# Altium project bitfury_power.PrjPCB
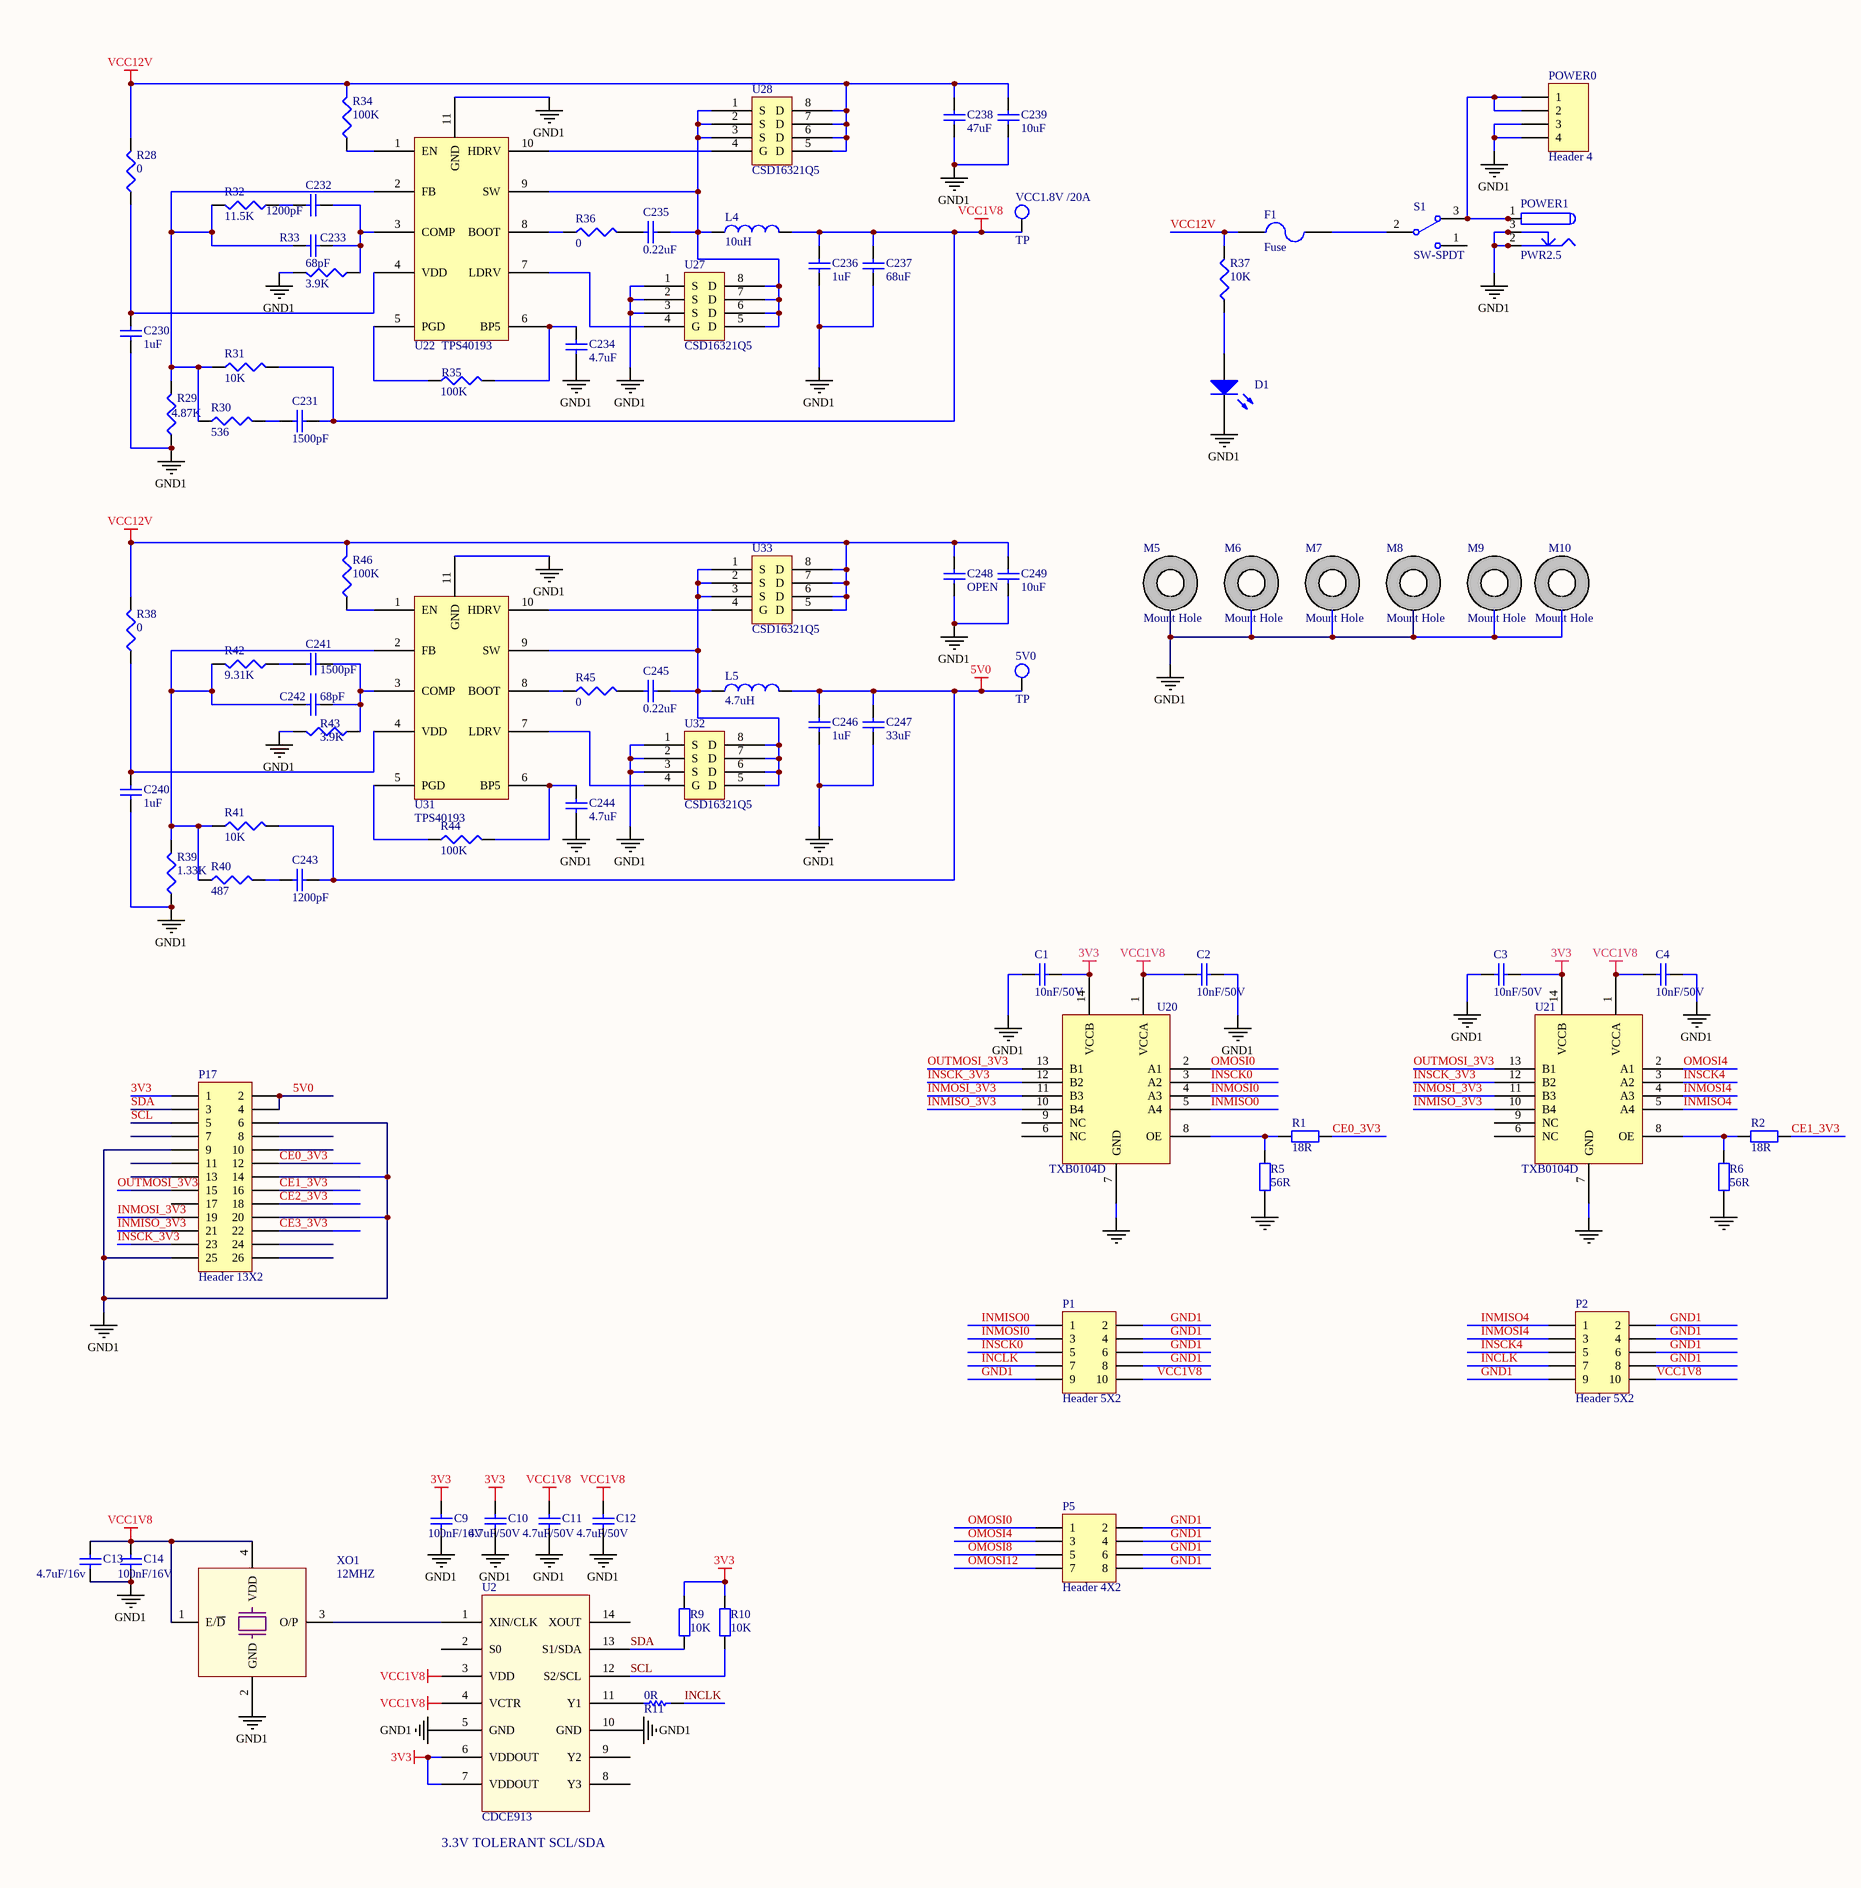
[diagram p0: bitfury_power.SchDoc, left]
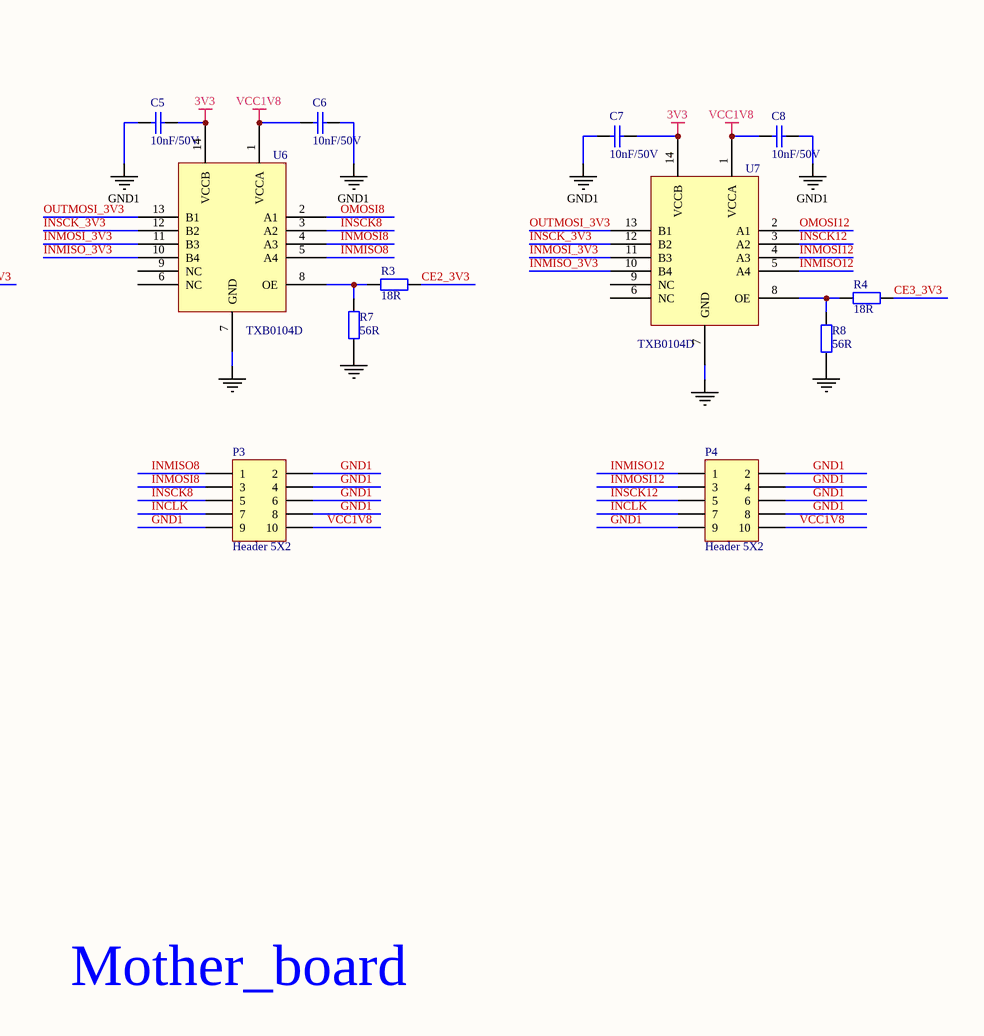
[diagram p1: bitfury_power.SchDoc, right]
1 sheet, 97 parts. Net scope: global (net labels, ports and power ports of the same name join across sheets).
Board file: bitfury_power.PcbDoc

## Sheet bitfury_power.SchDoc
size A2; PageSetup: Record=PageOptions|CenterHorizontal=True|CenterVertical=True|PrintScale=0.49|XCorrection=1.00|YCorrection=1.00|PrintKind=1|BorderSize=5000000|LeftOffset=0|BottomOffset=0|Orientation=2|PaperLength=1000|PaperWidth=1000|Scale=100|PaperSource=7|PrintQuality=-4|MediaType=1|DitherType=10|PaperKind=A4 (210 x 297 mm)|PrintScaleMode=1

### Parts
5V0  TP  [PIN1]
C1  10nF/50V  [1608[0603]]
C2  10nF/50V  [1608[0603]]
C3  10nF/50V  [1608[0603]]
C4  10nF/50V  [1608[0603]]
C5  10nF/50V  [1608[0603]]
C6  10nF/50V  [1608[0603]]
C7  10nF/50V  [1608[0603]]
C8  10nF/50V  [1608[0603]]
C9  100nF/16V  [1608[0603]]
C10  4.7uF/50V  [1608[0603]]
C11  4.7uF/50V  [1608[0603]]
C12  4.7uF/50V  [1608[0603]]
C13  4.7uF/16v  [1608[0603]]
C14  100nF/16V  [1608[0603]]
C230  1uF  [1608[0603]]
C231  1500pF  [1608[0603]]
C232  1200pF  [1608[0603]]
C233  68pF  [1608[0603]]
C234  4.7uF  [1608[0603]]
C235  0.22uF  [1608[0603]]
C236  1uF  [1608[0603]]
C237  68uF  [C1210]
C238  47uF  [C1210]
C239  10uF  [C1210]
C240  1uF  [1608[0603]]
C241  1500pF  [1608[0603]]
C242  68pF  [1608[0603]]
C243  1200pF  [1608[0603]]
C244  4.7uF  [1608[0603]]
C245  0.22uF  [1608[0603]]
C246  1uF  [1608[0603]]
C247  33uF  [C1210]
C248  OPEN  [C1210]
C249  10uF  [C1210]
D1  (no value)  [CD1608-0603]
F1  Fuse  [RESC5025N1]
L4  10uH  [CDRH104RNP-120]
L5  4.7uH  [CDRH104RNP-120]
M5  Mount Hole  [MHOLE2]
M6  Mount Hole  [MHOLE2]
M7  Mount Hole  [MHOLE2]
M8  Mount Hole  [MHOLE2]
M9  Mount Hole  [MHOLE2]
M10  Mount Hole  [MHOLE2]
P1  Header 5X2  [HDR2X5]
P2  Header 5X2  [HDR2X5]
P3  Header 5X2  [HDR2X5]
P4  Header 5X2  [HDR2X5]
P5  Header 4X2  [HDR2X4]
P17  Header 13X2  [HDR2X13]
POWER0  Header 4  [SIP4]
POWER1  PWR2.5  [KLD-0202]
R1  18R  [6-0805_L]
R2  18R  [6-0805_L]
R3  18R  [6-0805_L]
R4  18R  [6-0805_L]
R5  56R  [6-0805_L]
R6  56R  [6-0805_L]
R7  56R  [6-0805_L]
R8  56R  [6-0805_L]
R9  10K  [6-0805_L]
R10  10K  [6-0805_L]
R11  0R  [6-0805_L]
R28  0  [6-0805_L]
R29  4.87K  [6-0805_L]
R30  536  [6-0805_L]
R31  10K  [6-0805_L]
R32  11.5K  [6-0805_L]
R33  3.9K  [6-0805_L]
R34  100K  [6-0805_L]
R35  100K  [6-0805_L]
R36  0  [6-0805_L]
R37  10K  [J1-0603]
R38  0  [6-0805_L]
R39  1.33K  [6-0805_L]
R40  487  [6-0805_L]
R41  10K  [6-0805_L]
R42  9.31K  [6-0805_L]
R43  3.9K  [6-0805_L]
R44  100K  [6-0805_L]
R45  0  [6-0805_L]
R46  100K  [6-0805_L]
S1  SW-SPDT  [SW3_S1]
U2  CDCE913  [TSSOP14 N]
U6  TXB0104D  [TXB0104-sop14]
U7  TXB0104D  [TXB0104-sop14]
U20  TXB0104D  [TXB0104-sop14]
U21  TXB0104D  [TXB0104-sop14]
U22  TPS40193
U27  CSD16321Q5  [CSD16321]
U28  CSD16321Q5  [CSD16321]
U31  TPS40193  [SON-N10]
U32  CSD16321Q5  [CSD16321]
U33  CSD16321Q5  [CSD16321]
VCC1.8V_/20A  TP  [PIN1]
XO1  12MHZ  [OSC 7.5x5.2]

### Nets
3V3: C1.2 C3.2 C5.2 C7.2 C9.2 C10.2 P17.1 R9.1 R10.2 U2.6(VDDOUT) U2.7(VDDOUT) U6.14(VCCB) U7.14(VCCB) U20.14(VCCB) U21.14(VCCB)
5V0: 5V0.1(TP) C243.2 C246.2 C247.2 L5.2 P17.2 P17.4 R41.2
GND1: C1.1 C2.2 C3.1 C4.2 C5.1 C6.2 C7.1 C8.2 C9.1 C10.1 C11.1 C12.1 C13.2 C14.1 C230.1 C234.1 C236.1 C237.1 C238.1 C239.1 C240.1 C244.1 C246.1 C247.1 C248.1 C249.1 D1.2(K) M5.0(PIN) M6.0(PIN) M7.0(PIN) M8.0(PIN) M9.0(PIN) M10.0(PIN) P1.2 P1.4 P1.6 P1.8 P1.9 P2.2 P2.4 P2.6 P2.8 P2.9 P3.2 P3.4 P3.6 P3.8 P3.9 P4.2 P4.4 P4.6 P4.8 P4.9 P5.2 P5.4 P5.6 P5.8 P17.6 P17.9 P17.14 P17.20 P17.25 POWER0.3 POWER0.4 POWER1.2 POWER1.2A POWER1.2B POWER1.3 POWER1.3A POWER1.3B R5.1 R6.1 R7.1 R8.1 R29.1 R33.2 R39.1 R43.2 U2.5(GND) U2.10(GND) U6.7(GND) U7.7(GND) U20.7(GND) U21.7(GND) U22.11(GND) U27.1(S) U27.2(S) U27.3(S) U31.11(GND) U32.1(S) U32.2(S) U32.3(S) XO1.2(GND)
VCC1V8: C2.1 C4.1 C6.1 C8.1 C11.2 C12.2 C13.1 C14.2 C231.2 C236.2 C237.2 L4.2 P1.10 P2.10 P3.10 P4.10 R31.2 U2.3(VDD) U2.4(VCTR) U6.1(VCCA) U7.1(VCCA) U20.1(VCCA) U21.1(VCCA) VCC1.8V_/20A.1(TP) XO1.1(E/~{D}) XO1.4(VDD)
VCC12V: C238.2 C239.2 C248.2 C249.2 F1.1 R28.2 R34.2 R37.2 R38.2 R46.2 U28.5(D) U28.6(D) U28.7(D) U28.8(D) U33.5(D) U33.6(D) U33.7(D) U33.8(D)
CE0_3V3: P17.12 R1.2
CE1_3V3: P17.16 R2.2
CE2_3V3: P17.18 R3.2
CE3_3V3: P17.22 R4.2
INCLK: P1.7 P2.7 P3.7 P4.7 R11.1
INMISO0: P1.1 U20.5(A4)
INMISO4: P2.1 U21.5(A4)
INMISO8: P3.1 U6.5(A4)
INMISO12: P4.1 U7.5(A4)
INMISO_3V3: P17.21 U6.10(B4) U7.10(B4) U20.10(B4) U21.10(B4)
INMOSI0: P1.3 U20.4(A3)
INMOSI4: P2.3 U21.4(A3)
INMOSI8: P3.3 U6.4(A3)
INMOSI12: P4.3 U7.4(A3)
INMOSI_3V3: P17.19 U6.11(B3) U7.11(B3) U20.11(B3) U21.11(B3)
INSCK0: P1.5 U20.3(A2)
INSCK4: P2.5 U21.3(A2)
INSCK8: P3.5 U6.3(A2)
INSCK12: P4.5 U7.3(A2)
INSCK_3V3: P17.23 U6.12(B2) U7.12(B2) U20.12(B2) U21.12(B2)
OMOSI0: P5.1 U20.2(A1)
OMOSI4: P5.3 U21.2(A1)
OMOSI8: P5.5 U6.2(A1)
OMOSI12: P5.7 U7.2(A1)
OUTMOSI_3V3: P17.15 U6.13(B1) U7.13(B1) U20.13(B1) U21.13(B1)
SCL: P17.5 R10.1 U2.12(S2/SCL)
SDA: P17.3 R9.2 U2.13(S1/SDA)
NetC230_2: C230.2 R28.1 U22.4(VDD)
NetC231_1: C231.1 R30.2
NetC232_1: C232.1 R32.1
NetC232_2: C232.2 C233.2 R33.1 U22.3(COMP)
NetC233_1: C233.1 R29.2 R30.1 R31.1 R32.2 U22.2(FB)
NetC234_2: C234.2 R35.2 U22.6(BP5)
NetC235_1: C235.1 L4.1 U22.9(SW) U27.5(D) U27.6(D) U27.7(D) U27.8(D) U28.1(S) U28.2(S) U28.3(S)
NetC235_2: C235.2 R36.2
NetC240_2: C240.2 R38.1 U31.4(VDD)
NetC241_1: C241.1 R42.1
NetC241_2: C241.2 C242.2 R43.1 U31.3(COMP)
NetC242_1: C242.1 R39.2 R40.1 R41.1 R42.2 U31.2(FB)
NetC243_1: C243.1 R40.2
NetC244_2: C244.2 R44.2 U31.6(BP5)
NetC245_1: C245.1 L5.1 U31.9(SW) U32.5(D) U32.6(D) U32.7(D) U32.8(D) U33.1(S) U33.2(S) U33.3(S)
NetC245_2: C245.2 R45.2
NetD1_1: D1.1(A) R37.1
NetF1_2: F1.2 S1.2
NetPOWER0_1: POWER0.1 POWER0.2 POWER1.1 POWER1.1A POWER1.1B S1.3
NetR1_1: R1.1 R5.2 U20.8(OE)
NetR2_1: R2.1 R6.2 U21.8(OE)
NetR3_1: R3.1 R7.2 U6.8(OE)
NetR4_1: R4.1 R8.2 U7.8(OE)
NetR11_2: R11.2 U2.11(Y1)
NetR34_1: R34.1 U22.1(EN)
NetR35_1: R35.1 U22.5(PGD)
NetR36_1: R36.1 U22.8(BOOT)
NetR44_1: R44.1 U31.5(PGD)
NetR45_1: R45.1 U31.8(BOOT)
NetR46_1: R46.1 U31.1(EN)
NetU2_1: U2.1(XIN/CLK) XO1.3(O/P)
NetU22_7: U22.7(LDRV) U27.4(G)
NetU22_10: U22.10(HDRV) U28.4(G)
NetU31_7: U31.7(LDRV) U32.4(G)
NetU31_10: U31.10(HDRV) U33.4(G)

Not connected (* = marked no-connect by the designer): P17 7 8 10 11 13 17 24 26; S1 1; U2 2(S0) 8(Y3) 9(Y2) 14(XOUT); U6 6(NC) 9(NC); U7 6(NC) 9(NC); U20 6(NC) 9(NC); U21 6(NC) 9(NC)

### Notes on the sheet
- (near U2) 3.3V TOLERANT SCL/SDA
- Mother_board

### Library data of the parts
C1-C14 C230-C249 = Cap: Capacitor; Published: 8-Jun-2000; LatestRevisionDate: 17-Jul-2002; LatestRevisionNote: Re-released for DXP Platform.; PackageReference: RAD-0.3; Publisher: Altium Limited; PackageDescription: Radial Cap, Thru-Hole; 2 Leads; 0.3 in Pin Spacing
  C1-C8: Value: 10nF/50V
  C9 C14: Value: 100nF/16V
  C10-C12: Value: 4.7uF/50V
  C13: Value: 4.7uF/16v
  C230 C236 C240 C246: Value: 1uF
  C231 C241: Value: 1500pF
  C232 C243: Value: 1200pF
  C233 C242: Value: 68pF
  C234 C244: Value: 4.7uF
  C235 C245: Value: 0.22uF
  C237: Value: 68uF
  C238: Value: 47uF
  C239 C249: Value: 10uF
  C247: Value: 33uF
  C248: Value: OPEN
D1 = LED3: Typical BLUE SiC LED; Published: 8-Jun-2000; LatestRevisionDate: 17-Dec-2003; LatestRevisionNote: PCB Footprint replaced.; DatasheetVersion: 16-Apr-2002; PackageVersion: 16-Apr-2002; PackageReference: 3.5X2.8X1.9; Publisher: Altium Limited; PackageDescription: SM LED; 2 C-Bend Leads; Body 3.5 x 2.8 x 1.9 mm, inc leads (LxWxH typ)
F1 = Fuse 2: Published: 8-Jun-2000; LatestRevisionDate: 17-Jul-2002; LatestRevisionNote: Re-released for DXP Platform.; PackageReference: PIN-W2/E2.8; Publisher: Altium Limited
L4 L5 = Inductor: Code_IEC: 1005; Published: 8-Jun-2000; LatestRevisionDate: 29-May-2009; LatestRevisionNote: IPC-7351 Footprint Added.; PackageReference: 0402-A; Publisher: Altium Limited; PackageDescription: Chip Inductor; Code_JEITA: 0402
  L4: Value: 10uH
  L5: Value: 4.7uH
M5-M10 = M_Hole
P1-P4 = Header 5X2: Header, 5-Pin, Dual row; LatestRevisionDate: 17-Jul-2002; LatestRevisionNote: Re-released for DXP Platform.; Publisher: Altium Limited
P5 = Header 4X2: Header, 4-Pin, Dual row; LatestRevisionDate: 17-Jul-2002; LatestRevisionNote: Re-released for DXP Platform.; Publisher: Altium Limited
P17 = Header 13X2: Header, 13-Pin, Dual row; LatestRevisionDate: 17-Jul-2002; LatestRevisionNote: Re-released for DXP Platform.; Publisher: Altium Limited
POWER0 = Header 4: Header, 4-Pin; LatestRevisionDate: 17-Jul-2002; LatestRevisionNote: Re-released for DXP Platform.; Publisher: Altium Limited
POWER1 = PWR2.5: Low Voltage Power Supply Connector; Published: 17-Dec-2003; DatasheetDocument: 09-May-2002; Publisher: Altium Limited; ComponentLink1Description: Manufacturer Link; ComponentLink1URL: http://domino.kycon.com/internet/Products.html
R1-R10 = Res2: Resistor; Published: 8-Jun-2000; LatestRevisionDate: 17-Jul-2002; LatestRevisionNote: Re-released for DXP Platform.; PackageReference: AXIAL-0.4; Publisher: Altium Limited; PackageDescription: Axial Device, Thru-Hole; 2 Leads; 0.4 in Pin Spacing
  R1-R4: Value: 18R
  R5-R8: Value: 56R
  R9 R10: Value: 10K
R11 = default res SML 1: PART #: RC1608J000CS; ORDER CODE: 1276-3510-1-ND
R28-R46 = Res3: Resistor; Published: 8-Jun-2000; LatestRevisionDate: 29-May-2009; LatestRevisionNote: IPC-7351 Footprint Added.; PackageReference: J1-0603; Publisher: Altium Limited; PackageDescription: Chip Resistor
  R28 R36 R38 R45: Value: 0
  R29: Value: 4.87K
  R30: Value: 536
  R31 R37 R41: Value: 10K
  R32: Value: 11.5K
  R33 R43: Value: 3.9K
  R34 R35 R44 R46: Value: 100K
  R39: Value: 1.33K
  R40: Value: 487
  R42: Value: 9.31K
S1 = SW-SPDT: SPDT Subminiature Toggle Switch, Right Angle Mounting, Vertical Actuation; Published: 24-Mar-1999; LatestRevisionDate: 17-Dec-2003; LatestRevisionNote: Schematic revised, PCB Footprint replaced.; DatasheetVersion: 05-Dec-2000; PackageReference: TL36WW15050; Publisher: Altium Limited; PackageDescription: Switch; 4 Leads; ComponentLink1Description: Manufacturer Link; ComponentLink1URL: http://www.apem.com
U2 = CDCEL913: CLKC GEN; PART #: CDCEL913PW; ORDER CODE: 296-22917-5-ND
XO1 = CLK OSC XTL: OSCILLATOR; PART #: CB3LV-3C-12M0000; ORDER CODE: CTX292LVDKR-ND